# Altium schematic sheet H743ZI_SD_LCD_DRAM_Dev.SchDoc
size A1; SheetNumber: 1; SheetTotal: 1
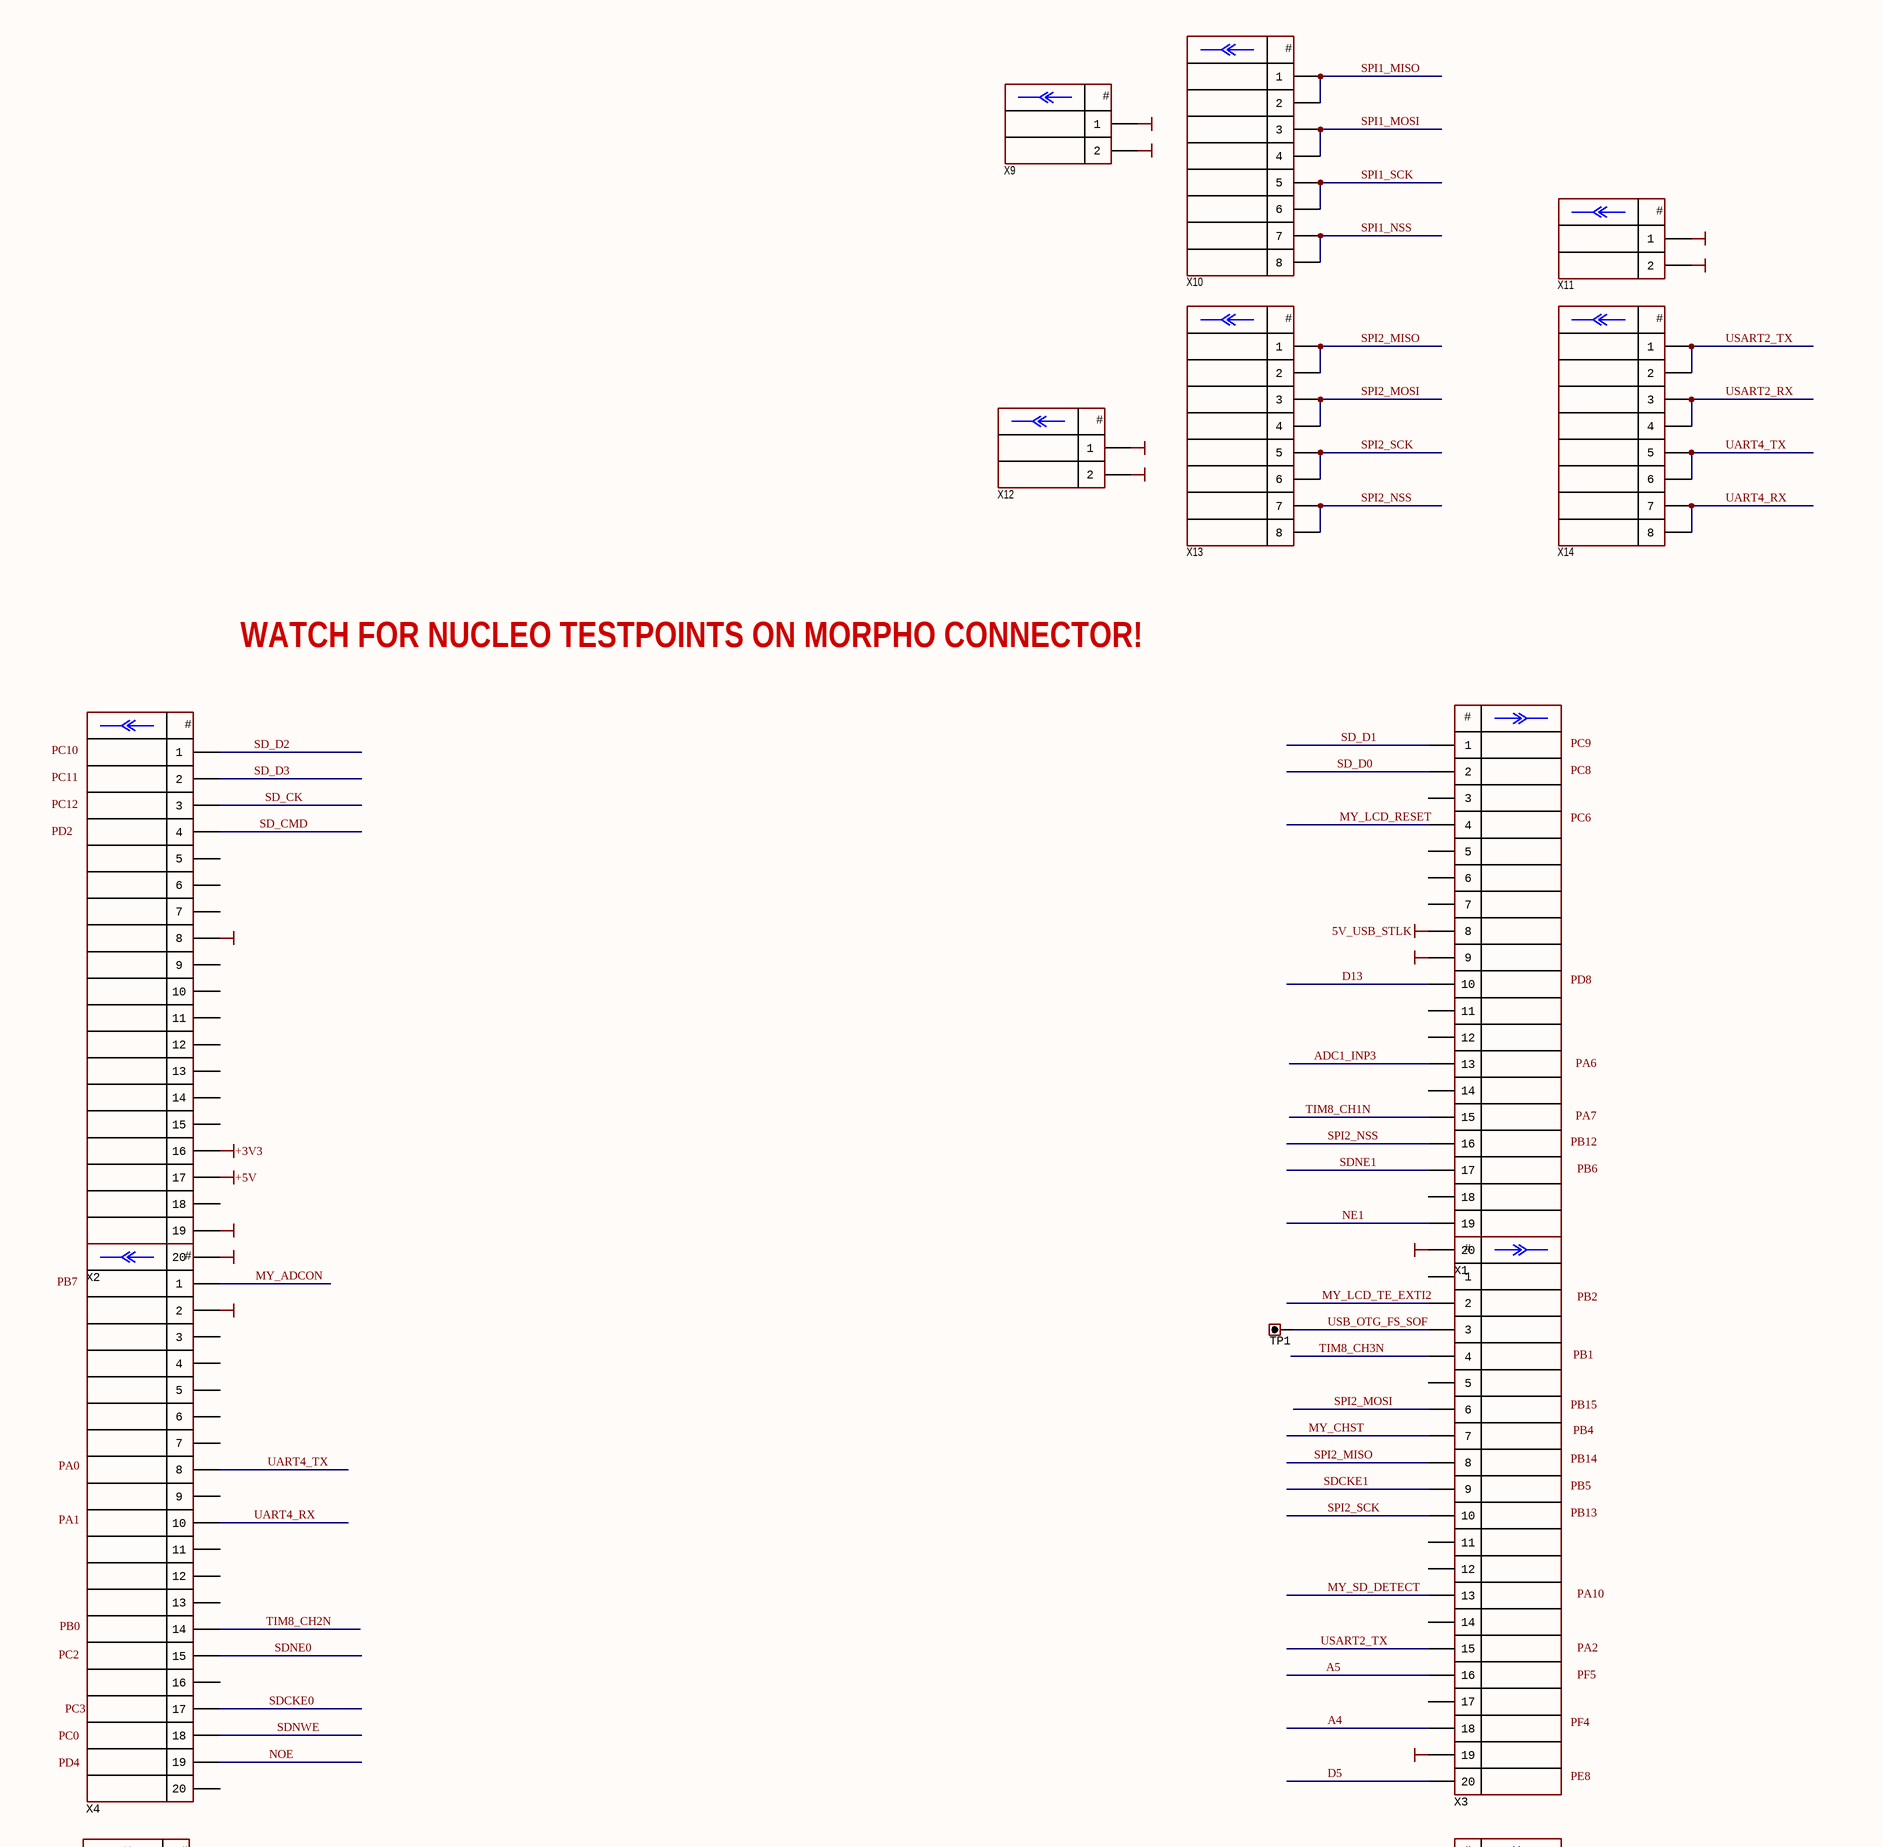
[diagram p0: H743ZI_SD_LCD_DRAM_Dev.SchDoc, top left]
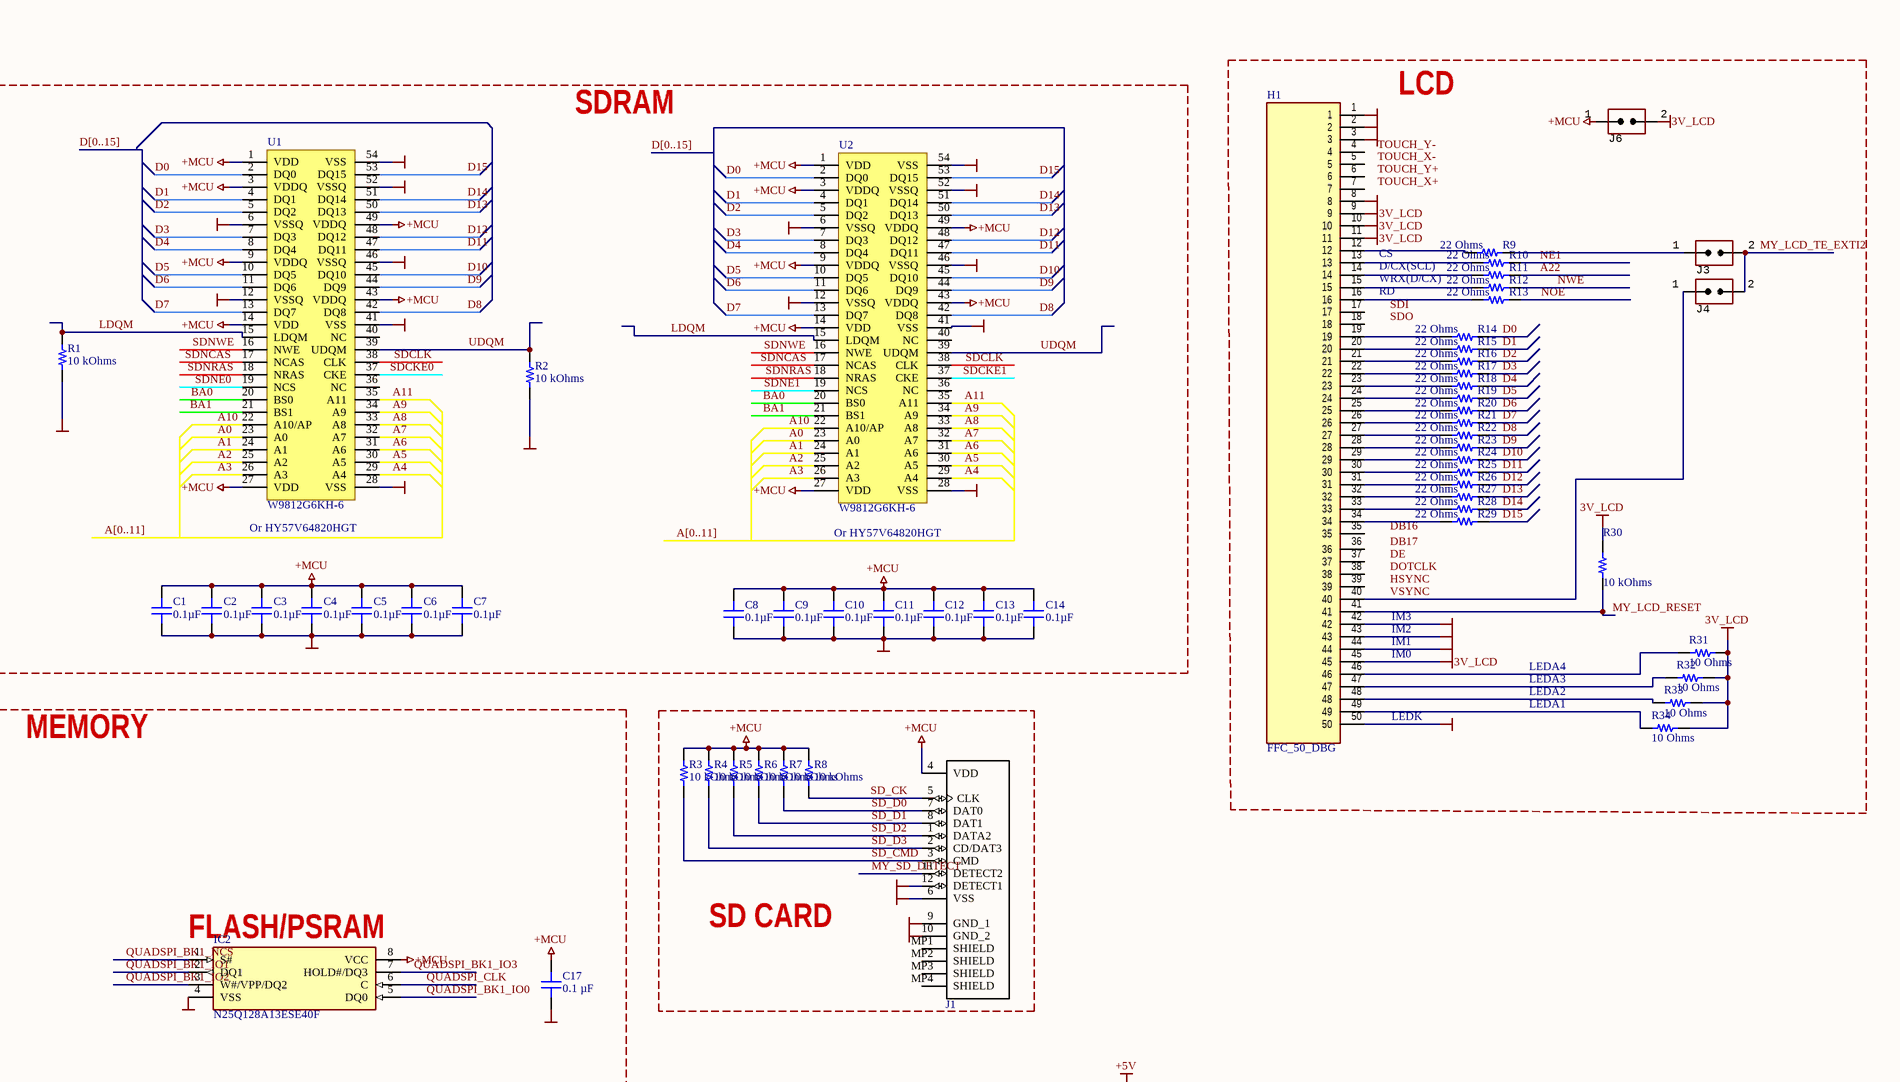
[diagram p1: H743ZI_SD_LCD_DRAM_Dev.SchDoc, top right]
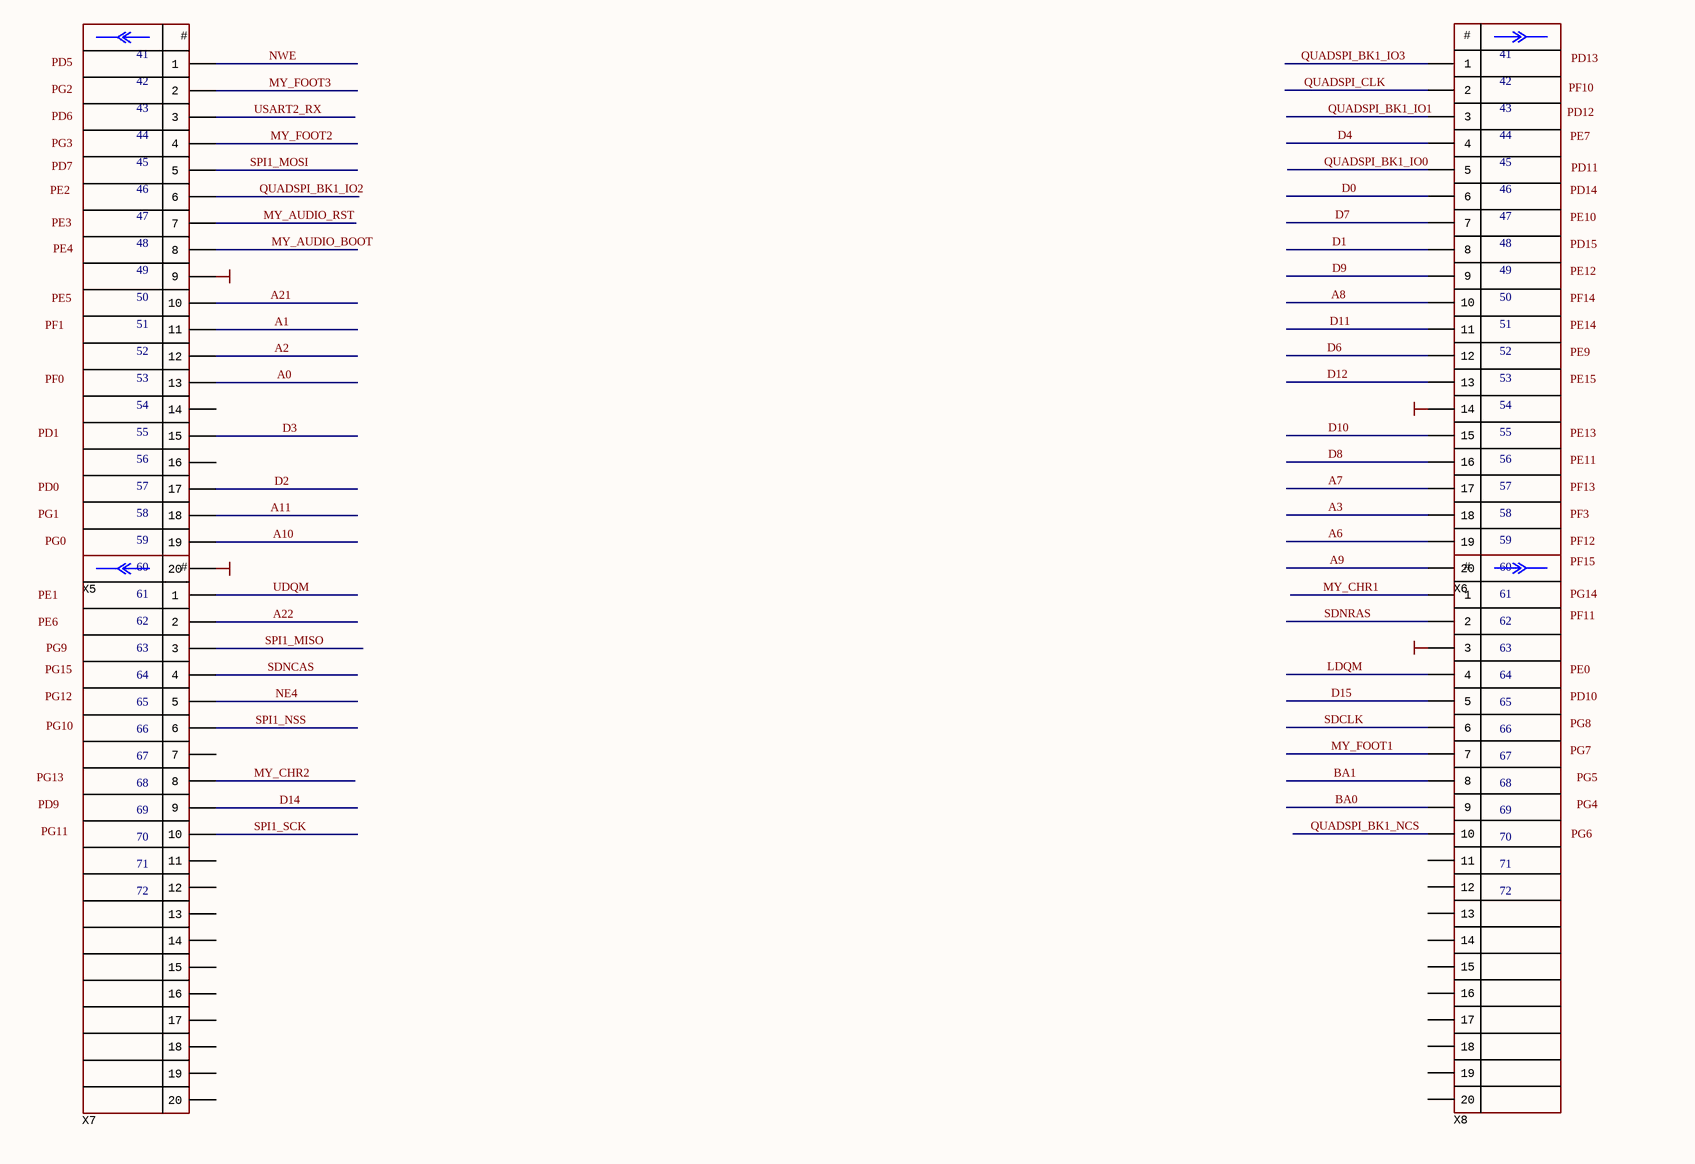
[diagram p2: H743ZI_SD_LCD_DRAM_Dev.SchDoc, bottom left]
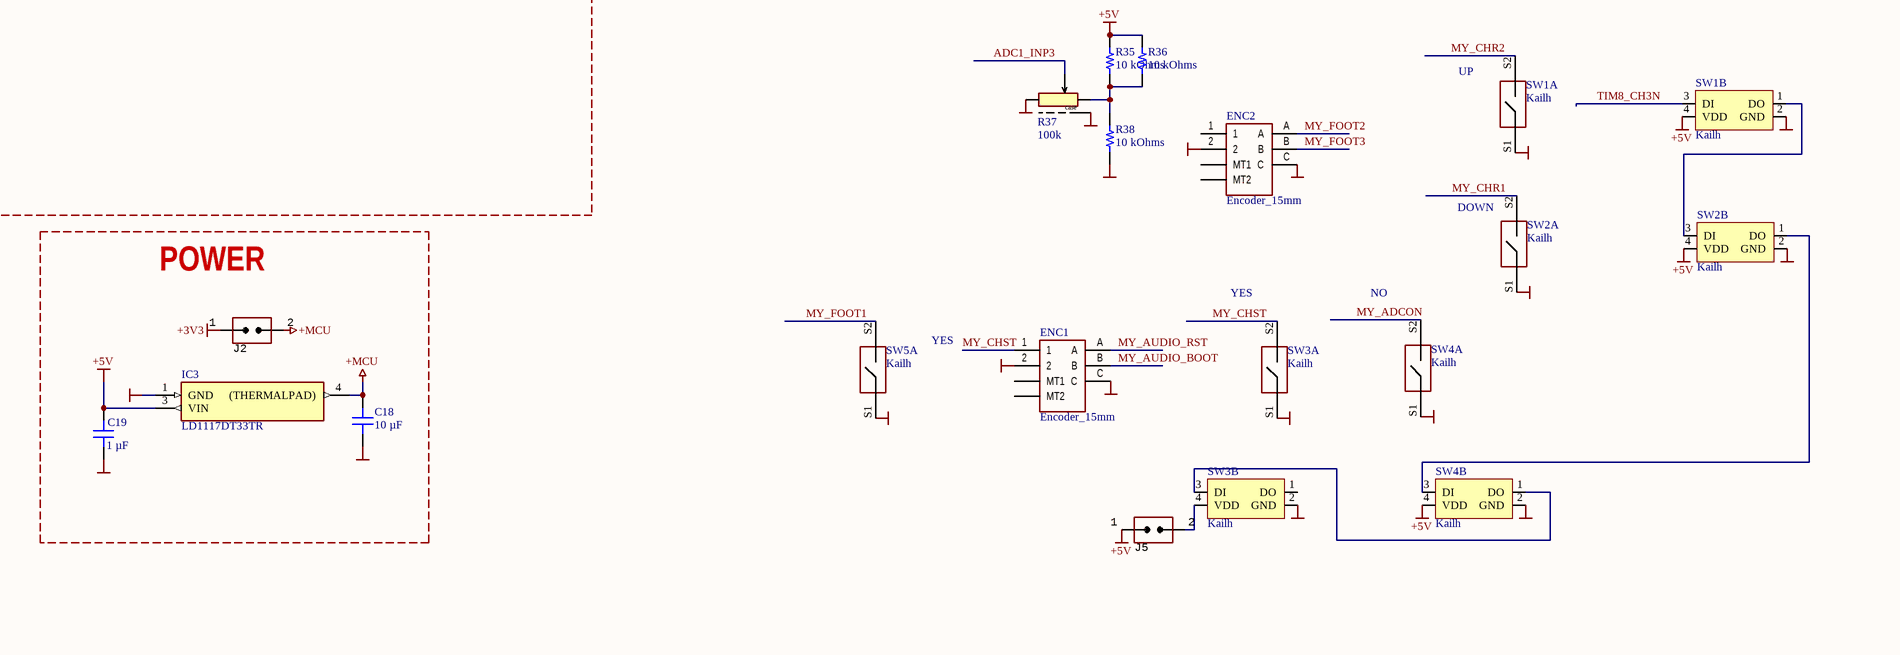
[diagram p3: H743ZI_SD_LCD_DRAM_Dev.SchDoc, bottom right]

## Parts
C1  0.1µF  [CAP 0402_1005]
C2  0.1µF  [CAP 0402_1005]
C3  0.1µF  [CAP 0402_1005]
C4  0.1µF  [CAP 0402_1005]
C5  0.1µF  [CAP 0402_1005]
C6  0.1µF  [CAP 0402_1005]
C7  0.1µF  [CAP 0402_1005]
C8  0.1µF  [CAP 0402_1005]
C9  0.1µF  [CAP 0402_1005]
C10  0.1µF  [CAP 0402_1005]
C11  0.1µF  [CAP 0402_1005]
C12  0.1µF  [CAP 0402_1005]
C13  0.1µF  [CAP 0402_1005]
C14  0.1µF  [CAP 0402_1005]
C17  0.1 µF  [CAP 0603_1608]
C18  10 µF  [CAP 0805_2012]
C19  1 µF  [CAP 0805_2012]
ENC1  Encoder_15mm  [EC11_15mm]
ENC2  Encoder_15mm  [EC11_15mm]
H1  FFC_50_DBG  [FFC_50_DBG]
IC2  N25Q128A13ESE40F  [SOIC127P790X216-8N]
IC3  LD1117DT33TR  [TO228P972X240-3N]
J1  SCHA4B0400  [SCHA4B0400]  (value not drawn)
J2  (no value)  [CON: JUMPER x1]
J3  (no value)  [CON: JUMPER x1]
J4  (no value)  [CON: JUMPER x1]
J5  (no value)  [CON: JUMPER x1]
J6  (no value)  [CON: JUMPER x1]
R1  10 kOhms  [RES 0603_1608]
R2  10 kOhms  [RES 0603_1608]
R3  10 kOhms  [RES 0603_1608]
R4  10 kOhms  [RES 0603_1608]
R5  10 kOhms  [RES 0603_1608]
R6  10 kOhms  [RES 0603_1608]
R7  10 kOhms  [RES 0603_1608]
R8  10 kOhms  [RES 0603_1608]
R9  22 Ohms  [RES 0402_1005]
R10  22 Ohms  [RES 0402_1005]
R11  22 Ohms  [RES 0402_1005]
R12  22 Ohms  [RES 0402_1005]
R13  22 Ohms  [RES 0402_1005]
R14  22 Ohms  [RES 0402_1005]
R15  22 Ohms  [RES 0402_1005]
R16  22 Ohms  [RES 0402_1005]
R17  22 Ohms  [RES 0402_1005]
R18  22 Ohms  [RES 0402_1005]
R19  22 Ohms  [RES 0402_1005]
R20  22 Ohms  [RES 0402_1005]
R21  22 Ohms  [RES 0402_1005]
R22  22 Ohms  [RES 0402_1005]
R23  22 Ohms  [RES 0402_1005]
R24  22 Ohms  [RES 0402_1005]
R25  22 Ohms  [RES 0402_1005]
R26  22 Ohms  [RES 0402_1005]
R27  22 Ohms  [RES 0402_1005]
R28  22 Ohms  [RES 0402_1005]
R29  22 Ohms  [RES 0402_1005]
R30  10 kOhms  [RES 0603_1608]
R31  10 Ohms  [RES 0603_1608]
R32  10 Ohms  [RES 0603_1608]
R33  10 Ohms  [RES 0603_1608]
R34  10 Ohms  [RES 0603_1608]
R35  10 kOhms  [RES 0603_1608]
R36  10 kOhms  [RES 0603_1608]
R37  100k  [POT]
R38  10 kOhms  [RES 0603_1608]
SW1  Kailh  [KAILH_UNI_MX_WS2812]  (parts A,B of 2)
SW2  Kailh  [KAILH_UNI_MX_WS2812]  (parts A,B of 2)
SW3  Kailh  [KAILH_UNI_MX_WS2812]  (parts A,B of 2)
SW4  Kailh  [KAILH_UNI_MX_WS2812]  (parts A,B of 2)
SW5  Kailh  [KAILH_UNI_MX_WS2812]  (part A of 2)
TP1  (no value)  [CON: 5116 (Keystone)]
U1  W9812G6KH-6  [TSOP-54]
U2  W9812G6KH-6  [TSOP-54]
X1  (no value)  [CON: PBD-20]
X2  (no value)  [CON: PBD-20]
X3  (no value)  [CON: PBD-20]
X4  (no value)  [CON: PBD-20]
X5  (no value)  [CON: PBD-20]
X6  (no value)  [CON: PBD-20]
X7  (no value)  [CON: PBD-20]
X8  (no value)  [CON: PBD-20]
X9  (no value)  [CON: PLS-2]
X10  (no value)  [CON: PLD-8]
X11  (no value)  [CON: PLS-2]
X12  (no value)  [CON: PLS-2]
X13  (no value)  [CON: PLD-8]
X14  (no value)  [CON: PLD-8]

## Blocks framed on the sheet
LCD: H1 J3 J4 J6 R9-R34
SDRAM: C1-C14 R1 R2 U1 U2
SD CARD: J1 R3-R8
POWER: C18 C19 IC3 J2

## Nets
3V_LCD: H1.9 H1.10 H1.11 H1.45 J6.2(IN) R30.2 R31.2 R32.2 R33.2 R34.2
5V_USB_STLK: X1.8
+3V3: J2.1(IN) X2.16
+5V: C19.2 IC3.3(VIN) J5.1(IN) R35.2 R36.2 SW1.4(VDD) SW2.4(VDD) SW4.4(VDD) X2.17
+MCU: C1.1 C2.1 C3.1 C4.1 C5.1 C6.1 C7.1 C8.1 C9.1 C10.1 C11.1 C12.1 C13.1 C14.1 C17.2 C18.2 IC2.8(VCC) IC3.4((THERMALPAD)) J1.4(VDD) J2.2(IN) J6.1(IN) R3.2 R4.2 R5.2 R6.2 R7.2 R8.2 U1.1(VDD) U1.3(VDDQ) U1.9(VDDQ) U1.14(VDD) U1.27(VDD) U1.43(VDDQ) U1.49(VDDQ) U2.1(VDD) U2.3(VDDQ) U2.9(VDDQ) U2.14(VDD) U2.27(VDD) U2.43(VDDQ) U2.49(VDDQ)
GND: C1.2 C2.2 C3.2 C4.2 C5.2 C6.2 C7.2 C8.2 C9.2 C10.2 C11.2 C12.2 C13.2 C14.2 C17.1 C18.1 C19.1 ENC1.2 ENC1.C ENC2.2 ENC2.C H1.1 H1.2 H1.3 H1.8 H1.42 H1.43 H1.44 H1.50 IC2.4(VSS) IC3.1(GND) J1.6(VSS) J1.9(GND_1) J1.10(GND_2) J1.12(DETECT1) R1.1 R2.1 R37.1 R37.4 R38.1 SW1.2(GND) SW1.S1 SW2.2(GND) SW2.S1 SW3.2(GND) SW3.S1 SW4.2(GND) SW4.S1 SW5.S1 U1.6(VSSQ) U1.12(VSSQ) U1.28(VSS) U1.41(VSS) U1.46(VSSQ) U1.52(VSSQ) U1.54(VSS) U2.6(VSSQ) U2.12(VSSQ) U2.28(VSS) U2.41(VSS) U2.46(VSSQ) U2.52(VSSQ) U2.54(VSS) X1.9 X1.20 X2.8 X2.19 X2.20 X3.19 X4.2 X5.9 X5.20 X6.14 X8.3 X9.1 X9.2 X11.1 X11.2 X12.1 X12.2
A0: U1.23(A0) U2.23(A0) X5.13
A1: U1.24(A1) U2.24(A1) X5.11
A2: U1.25(A2) U2.25(A2) X5.12
A3: U1.26(A3) U2.26(A3) X6.18
A4: U1.29(A4) U2.29(A4) X3.18
A5: U1.30(A5) U2.30(A5) X3.16
A6: U1.31(A6) U2.31(A6) X6.19
A7: U1.32(A7) U2.32(A7) X6.17
A8: U1.33(A8) U2.33(A8) X6.10
A9: U1.34(A9) U2.34(A9) X6.20
A10: U1.22(A10/AP) U2.22(A10/AP) X5.19
A11: U1.35(A11) U2.35(A11) X5.18
A21: X5.10
A22: R11.2 X7.2
ADC1_INP3: R37.2 X1.13
BA0: U1.20(BS0) U2.20(BS0) X8.9
BA1: U1.21(BS1) U2.21(BS1) X8.8
D0: R14.2 U1.2(DQ0) U2.2(DQ0) X6.6
D1: R15.2 U1.4(DQ1) U2.4(DQ1) X6.8
D2: R16.2 U1.5(DQ2) U2.5(DQ2) X5.17
D3: R17.2 U1.7(DQ3) U2.7(DQ3) X5.15
D4: R18.2 U1.8(DQ4) U2.8(DQ4) X6.4
D5: R19.2 U1.10(DQ5) U2.10(DQ5) X3.20
D6: R20.2 U1.11(DQ6) U2.11(DQ6) X6.12
D7: R21.2 U1.13(DQ7) U2.13(DQ7) X6.7
D8: R22.2 U1.42(DQ8) U2.42(DQ8) X6.16
D9: R23.2 U1.44(DQ9) U2.44(DQ9) X6.9
D10: R24.2 U1.45(DQ10) U2.45(DQ10) X6.15
D11: R25.2 U1.47(DQ11) U2.47(DQ11) X6.11
D12: R26.2 U1.48(DQ12) U2.48(DQ12) X6.13
D13: R27.2 U1.50(DQ13) U2.50(DQ13) X1.10
D14: R28.2 U1.51(DQ14) U2.51(DQ14) X7.9
D15: R29.2 U1.53(DQ15) U2.53(DQ15) X8.5
LDQM: R1.2 U1.15(LDQM) U2.15(LDQM) X8.4
MY_ADCON: SW4.S2 X4.1
MY_AUDIO_BOOT: ENC1.B X5.8
MY_AUDIO_RST: ENC1.A X5.7
MY_CHR1: SW2.S2 X8.1
MY_CHR2: SW1.S2 X7.8
MY_CHST: ENC1.1 SW3.S2 X3.7
MY_FOOT1: SW5.S2 X8.7
MY_FOOT2: ENC2.A X5.4
MY_FOOT3: ENC2.B X5.2
MY_LCD_RESET: H1.41 R30.1 X1.4
MY_LCD_TE_EXTI2: J3.2(IN) J4.2(IN) X3.2
MY_SD_DETECT: J1.11(DETECT2) X3.13
NE1: R10.2 X1.19
NE4: X7.5
NOE: R13.2 X4.19
NWE: R12.2 X5.1
QUADSPI_BK1_IO0: IC2.5(DQ0) X6.5
QUADSPI_BK1_IO1: IC2.2(DQ1) X6.3
QUADSPI_BK1_IO2: IC2.3(W#/VPP/DQ2) X5.6
QUADSPI_BK1_IO3: IC2.7(HOLD#/DQ3) X6.1
QUADSPI_BK1_NCS: IC2.1(S#) X8.10
QUADSPI_CLK: IC2.6(C) X6.2
SD_CK: J1.5(CLK) R8.1 X2.3
SD_CMD: J1.3(CMD) R3.1 X2.4
SD_D0: J1.7(DAT0) R7.1 X1.2
SD_D1: J1.8(DAT1) R6.1 X1.1
SD_D2: J1.1(DATA2) R5.1 X2.1
SD_D3: J1.2(CD/DAT3) R4.1 X2.2
SDCKE0: U1.37(CKE) X4.17
SDCKE1: U2.37(CKE) X3.9
SDCLK: U1.38(CLK) U2.38(CLK) X8.6
SDNCAS: U1.17(NCAS) U2.17(NCAS) X7.4
SDNE0: U1.19(NCS) X4.15
SDNE1: U2.19(NCS) X1.17
SDNRAS: U1.18(NRAS) U2.18(NRAS) X8.2
SDNWE: U1.16(NWE) U2.16(NWE) X4.18
SPI1_MISO: X7.3 X10.1 X10.2
SPI1_MOSI: X5.5 X10.3 X10.4
SPI1_NSS: X7.6 X10.7 X10.8
SPI1_SCK: X7.10 X10.5 X10.6
SPI2_MISO: X3.8 X13.1 X13.2
SPI2_MOSI: X3.6 X13.3 X13.4
SPI2_NSS: X1.16 X13.7 X13.8
SPI2_SCK: X3.10 X13.5 X13.6
TIM8_CH1N: X1.15
TIM8_CH2N: X4.14
TIM8_CH3N: SW1.3(DI) X3.4
UART4_RX: X4.10 X14.7 X14.8
UART4_TX: X4.8 X14.5 X14.6
UDQM: R2.2 U1.39(UDQM) U2.39(UDQM) X7.1
USART2_RX: X5.3 X14.3 X14.4
USART2_TX: X3.15 X14.1 X14.2
USB_OTG_FS_SOF: TP1.1 X3.3
VSYNC: H1.40 J4.1(IN)
NetH1_12: H1.12 R9.1
NetH1_13: H1.13 R10.1
NetH1_14: H1.14 R11.1
NetH1_15: H1.15 R12.1
NetH1_16: H1.16 R13.1
NetH1_19: H1.19 R14.1
NetH1_20: H1.20 R15.1
NetH1_21: H1.21 R16.1
NetH1_22: H1.22 R17.1
NetH1_23: H1.23 R18.1
NetH1_24: H1.24 R19.1
NetH1_25: H1.25 R20.1
NetH1_26: H1.26 R21.1
NetH1_27: H1.27 R22.1
NetH1_28: H1.28 R23.1
NetH1_29: H1.29 R24.1
NetH1_30: H1.30 R25.1
NetH1_31: H1.31 R26.1
NetH1_32: H1.32 R27.1
NetH1_33: H1.33 R28.1
NetH1_34: H1.34 R29.1
NetH1_46: H1.46 R31.1
NetH1_47: H1.47 R32.1
NetH1_48: H1.48 R33.1
NetH1_49: H1.49 R34.1
NetJ3_1: J3.1(IN) R9.2
NetJ5_2: J5.2(IN) SW3.4(VDD)
NetR35_1: R35.1 R36.1 R37.3 R38.2
NetSW1_1: SW1.1(DO) SW2.3(DI)
NetSW2_1: SW2.1(DO) SW4.3(DI)
NetSW3_3: SW3.3(DI) SW4.1(DO)

Not connected (* = marked no-connect by the designer): ENC1 MT1 MT2; ENC2 1 MT1 MT2; H1 4 5 6 7 17 18 35 36 37 38 39; J1 MP1(SHIELD) MP2(SHIELD) MP3(SHIELD) MP4(SHIELD); SW3 1(DO); U1 36(NC) 40(NC); U2 36(NC) 40(NC); X1 3 5 6 7 11 12 14 18; X2 5 6 7 9 10 11 12 13 14 15 18; X3 1 5 11 12 14 17; X4 3 4 5 6 7 9 11 12 13 16 20; X5 14 16; X7 7 11 12 13 14 15 16 17 18 19 20; X8 11 12 13 14 15 16 17 18 19 20

## Buses and harness runs
bus A[0..11]
bus D[0..15]

## Notes on the sheet
- D/CX(SCL)
- (near H1) CS
- WRX(D/CX)
- (near H1) RD
- WATCH FOR NUCLEO TESTPOINTS ON MORPHO CONNECTOR!
- (near U1) Or HY57V64820HGT
- (near U2) Or HY57V64820HGT
- IM0
- IM1
- IM2
- IM3
- LEDA4
- LEDK
- LEDA1
- LEDA2
- LEDA3
- MEMORY
- (near IC2) FLASH/PSRAM
- (near SW1) UP
- (near SW2) DOWN
- YES
- NO
- (near X5) 41
- (near X6) 41
- (near X5) 42
- (near X5) 43
- (near X5) 44
- (near X6) 42
- (near X6) 43
- (near X6) 44
- (near X5) 45
- (near X5) 46
- (near X6) 45
- (near X6) 46
- (near X5) 47
- (near X5) 48
- (near X5) 49
- (near X6) 47
- (near X6) 48
- (near X6) 49
- (near X5) 50
- (near X5) 51
- (near X6) 50
- (near X6) 51
- (near X5) 52
- (near X5) 53
- (near X5) 54
- (near X6) 52
- (near X6) 53
- (near X6) 54
- (near X5) 55
- (near X5) 56
- (near X6) 55
- (near X6) 56
- (near X5) 57
- (near X5) 58
- 59
- (near X6) 57
- (near X6) 58
- 60
- 61
- 62
- (near X7) 63
- (near X7) 64
- (near X8) 63
- (near X8) 64
- (near X7) 65
- (near X7) 66
- (near X8) 65
- (near X8) 66
- (near X7) 67
- (near X7) 68
- (near X7) 69
- (near X8) 67
- (near X8) 68
- (near X8) 69
- (near X7) 70
- (near X7) 71
- (near X8) 70
- (near X8) 71
- (near X7) 72
- (near X8) 72
- Labels drawn without touching a wire or pin: DB16, DB17, DE, DOTCLK, HSYNC, PA0, PA1, PA2, PA6, PA7, PA10, PB0, PB1, PB2, PB4, PB5, PB6, PB7, PB12, PB13, PB14, PB15, PC0, PC2, PC3, PC6, PC8, PC9, PC10, PC11, PC12, PD0, PD1, PD2, PD4, PD5, PD6, PD7, PD8, PD9, PD10, PD11, PD12, PD13, PD14, PD15, PE0, PE1, PE2, PE3, PE4, PE5, PE6, PE7, PE8, PE9, PE10, PE11, PE12, PE13, PE14, PE15, PF0, PF1, PF3, PF4, PF5, PF10, PF11, PF12, PF13, PF14, PF15, PG0, PG1, PG2, PG3, PG4, PG5, PG6, PG7, PG8, PG9, PG10, PG11, PG12, PG13, PG14, PG15, SDI, SDO, TOUCH_X+, TOUCH_X-, TOUCH_Y+, TOUCH_Y-
- (in symbol PBD-20) #
- (in symbol PLD-8) #
- (in symbol PLS-2) #
- (in symbol POT 9MM 100K) case

## Library data of the parts
C1-C14 = C0402C104K4RACAUTO: CAP CER 0.1UF 16V X7R 0402; Manufacturer: KEMET; Tolerance: ±10%; Part Number: C0402C104K4RACAUTO; Value: 0.1µF; Applications: Automotive, Bypass, Decoupling; Capacitance: 0.1µF; ComponentLink1Description: Datasheet; ComponentLink1URL: https://api.kemet.com/component-edge/download/specsheet/C0402C104K4RACAUTO.pdf; ComponentLink2Description: DigiKey Link; ComponentLink2URL: http://digikey.com/product-detail/en/kemet/C0402C104K4RACAUTO/399-6828-1-ND/3314343; Device Package: 0402 (1005 Metric); LastUpdated: 9/2/2020 1:02:21 AM; Lifecycle Status: Active; Minimum Order: 1; Mounting Type: Surface Mount, MLCC; Operating Temperature: -55°C ~ 125°C; Package / Case: 0402 (1005 Metric); Packaging: TapeAndReel; PartId: 3024; Part Status: Active; Price: 0.01; Ratings: AEC-Q200; Series: SMD Auto X7R; Size / Dimension: 0.039" L x 0.020" W (1.00mm x 0.50mm); Supplier 1: DigiKey; Supplier Part Number 1: 399-6828-1-ND; Temperature Coefficient: X7R; Thickness (Max): 0.022" (0.55mm); Voltage - Rated: 16V
C17 = C0603C104K5RAC7411: CAP CER 0.1UF 50V X7R 0603; manufacturer: KEMET; Tolerance: ±10%; Part Number: C0603C104K5RAC7411; Value: 0.1 µF; Applications: Bypass, Decoupling; Capacitance: 0.1 µF; componentlink1description: Datasheet; componentlink1url: https://api.kemet.com/component-edge/download/datasheet/C0603C104K5RAC7411.pdf; componentlink2description: DigiKey Link; componentlink2url: https://www.digikey.com/en/products/detail/kemet/C0603C104K5RAC7411/3317013; Device Package: 0603 (1608 Metric); lastupdated: 2/9/2024 8:10:30 PM; Lifecycle Status: Active; Minimum Order: 1; Mounting Type: Surface Mount, MLCC; Operating Temperature: -55°C ~ 125°C; Package / Case: 0603 (1608 Metric); packaging: TapeAndReel; partid: 2233; Part Status: Active; price: 0.01; series: SMD Comm X7R; Size / Dimension: 0.063" L x 0.031" W (1.60mm x 0.80mm); Supplier 1: DigiKey; Supplier Part Number 1: 399-C0603C104K5RAC7411CT-ND; Temperature Coefficient: X7R; Thickness (Max): 0.035" (0.90mm); Voltage - Rated: 50V
C18 = C0805C106K8PAC7800: CAP CER 10UF 10V X5R 0805; manufacturer: KEMET; Tolerance: ±10%; Part Number: C0805C106K8PAC7800; Value: 10 µF; Applications: Bypass, Decoupling; Capacitance: 10 µF; componentlink1description: Datasheet; componentlink1url: https://connect.kemet.com:7667/gateway/IntelliData-ComponentDocumentation/1.0/download/datasheet/C0805C106K8PACTU; componentlink2description: DigiKey Link; componentlink2url: https://www.digikey.com/en/products/detail/kemet/C0805C106K8PAC7800/1090830; Device Package: 0805 (2012 Metric); lastupdated: 9/14/2022 7:51:56 AM; Lifecycle Status: Active; Minimum Order: 1; Mounting Type: Surface Mount, MLCC; Operating Temperature: -55°C ~ 85°C; Package / Case: 0805 (2012 Metric); packaging: TapeAndReel; partid: 44790; Part Status: Active; price: 0.02; series: SMD Comm X5R; Size / Dimension: 0.079" L x 0.049" W (2.00mm x 1.25mm); Supplier 1: DigiKey; Supplier Part Number 1: 399-C0805C106K8PAC7800CT-ND; Temperature Coefficient: X5R; Thickness (Max): 0.055" (1.40mm); Voltage - Rated: 10V
C19 = C0805C105K4RAC7800: CAP CER 1UF 16V X7R 0805; manufacturer: KEMET; Tolerance: ±10%; Part Number: C0805C105K4RAC7800; Value: 1 µF; Applications: Bypass, Decoupling; Capacitance: 1 µF; componentlink1description: Datasheet; componentlink1url: https://api.kemet.com/component-edge/download/datasheet/C0805C105K4RACTU.pdf; componentlink2description: DigiKey Link; componentlink2url: https://www.digikey.com/en/products/detail/kemet/C0805C105K4RAC7800/416047; Device Package: 0805 (2012 Metric); lastupdated: 9/19/2022 1:03:30 PM; Lifecycle Status: Active; Minimum Order: 1; Mounting Type: Surface Mount, MLCC; Operating Temperature: -55°C ~ 125°C; Package / Case: 0805 (2012 Metric); packaging: TapeAndReel; partid: 32075; Part Status: Active; price: 0.01; series: SMD Comm X7R; Size / Dimension: 0.079" L x 0.049" W (2.00mm x 1.25mm); Supplier 1: DigiKey; Supplier Part Number 1: 399-C0805C105K4RAC7800CT-ND; Temperature Coefficient: X7R; Thickness (Max): 0.039" (1.00mm); Voltage - Rated: 16V
H1 = FFC_50_DBG: System: Connector
IC2 = N25Q128A13ESE40F: Integrated Circuit; Manufacturer_Name: Micron; Datasheet Link: https://datasheet.datasheetarchive.com/originals/distributors/Datasheets-DGA23/1494983.pdf; Height: 2.16mm; Manufacturer_Part_Number: N25Q128A13ESE40F; Mouser Part Number: 340-182267; Mouser Price/Stock: https://www.mouser.co.uk/ProductDetail/Micron/N25Q128A13ESE40F?qs=taEdVNyAfdHw8xv9Y4zfpQ%3D%3D; Arrow Part Number: N25Q128A13ESE40F; Arrow Price/Stock: https://www.arrow.com/en/products/n25q128a13ese40f/micron-technology
IC3 = LD1117DT33TR: Integrated Circuit; Manufacturer_Name: STMicroelectronics; Datasheet Link: http://www.st.com/web/en/resource/technical/document/datasheet/CD00000544.pdf; Height: 2.4mm; Manufacturer_Part_Number: LD1117DT33TR; Mouser Part Number: 511-LD1117DT33-TR; Mouser Price/Stock: https://www.mouser.co.uk/ProductDetail/STMicroelectronics/LD1117DT33TR?qs=4JhUBQGAOSd4P5jVYGxp2g%3D%3D; Arrow Part Number: LD1117DT33TR; Arrow Price/Stock: https://www.arrow.com/en/products/ld1117dt33tr/stmicroelectronics?region=nac
J1 = SCHA4B0400: SD card Connector; Manufacturer_Name: ALPS Electric; Datasheet Link: https://br.mouser.com/datasheet/2/15/SCHA-1155938.pdf; Height: 1.29mm; Manufacturer_Part_Number: SCHA4B0400; Mouser Part Number: 688-SCHA4B0400; Mouser Price/Stock: https://www.mouser.com/Search/Refine.aspx?Keyword=688-SCHA4B0400
J2-J6 = Jumper_single: CommentText: "Перемычка"
R1-R8 R30 = ERJ-3EKF1002V: RES SMD 10K OHM 1% 1/10W 0603; Manufacturer: Panasonic Electronic Components; Power (Watts): 0.1W, 1/10W; Temperature Coefficient: ±100ppm/°C; Part Number: ERJ-3EKF1002V; Value: 10 kOhms; ComponentLink1Description: Datasheet; ComponentLink1URL: https://industrial.panasonic.com/cdbs/www-data/pdf/RDA0000/AOA0000C304.pdf; ComponentLink2Description: DigiKey Link; ComponentLink2URL: https://www.digikey.com/en/products/detail/panasonic-electronic-components/ERJ-3EKF1002V/196066; Composition: Thick Film; Device Package: 0603 (1608 Metric); Height - Seated (Max): 0.022" (0.55mm); LastUpdated: 2/9/2024 8:41:59 PM; Lifecycle Status: Active; Minimum Order: 1; Number of Terminations: 2; Operating Temperature: -55°C ~ 155°C; Package / Case: 0603 (1608 Metric); Packaging: TapeAndReel; PartId: 25695; Part Status: Active; Price: 0.01; Resistance: 10 kOhms; Series: ERJ-3EK; Size / Dimension: 0.063" L x 0.031" W (1.60mm x 0.80mm); Supplier 1: DigiKey; Supplier Part Number 1: P10.0KHCT-ND; Supplier Device Package: 0603; Tolerance: ±1%; Features: Automotive AEC-Q200; Ratings: AEC-Q200
R9-R29 = RMCF0402JT22R0: RES 22 OHM 5% 1/16W 0402; Manufacturer: Stackpole Electronics Inc; Power (Watts): 0.063W, 1/16W; Temperature Coefficient: ±100ppm/°C; Part Number: RMCF0402JT22R0; Value: 22 Ohms; ComponentLink1Description: Datasheet; ComponentLink1URL: https://www.seielect.com/catalog/sei-rmcf_rmcp.pdf; ComponentLink2Description: DigiKey Link; ComponentLink2URL: https://www.digikey.com/en/products/detail/stackpole-electronics-inc/RMCF0402JT22R0/1758165; Composition: Thick Film; Device Package: 0402 (1005 Metric); Features: Automotive AEC-Q200; Height - Seated (Max): 0.016" (0.40mm); LastUpdated: 2/9/2024 8:30:03 PM; Lifecycle Status: Active; Minimum Order: 1; Number of Terminations: 2; Operating Temperature: -55°C ~ 155°C; Package / Case: 0402 (1005 Metric); Packaging: CutTape; PartId: 7671; Part Status: Active; Price: 0.01; Resistance: 22 Ohms; Series: RMCF; Size / Dimension: 0.039" L x 0.020" W (1.00mm x 0.50mm); Supplier 1: DigiKey; Supplier Part Number 1: RMCF0402JT22R0CT-ND; Supplier Device Package: 0402; Tolerance: ±5%; Ratings: AEC-Q200
R31-R34 = ERJ-PA3F10R0V: RES SMD 10 OHM 1% 1/3W 0603; Manufacturer: Panasonic Electronic Components; Power (Watts): 0.333W, 1/3W; Temperature Coefficient: ±100ppm/°C; Part Number: ERJ-PA3F10R0V; Value: 10 Ohms; ComponentLink1Description: Datasheet; ComponentLink1URL: https://industrial.panasonic.com/cdbs/www-data/pdf/RDO0000/AOA0000C331.pdf; ComponentLink2Description: DigiKey Link; ComponentLink2URL: https://www.digikey.com/en/products/detail/panasonic-electronic-components/ERJ-PA3F10R0V/5035852; Composition: Thick Film; Device Package: 0603 (1608 Metric); Features: Automotive AEC-Q200, Pulse Withstanding; Height - Seated (Max): 0.022" (0.55mm); Lifecycle Status: Active; Minimum Order: 1; Number of Terminations: 2; Operating Temperature: -55°C ~ 155°C; Package / Case: 0603 (1608 Metric); Packaging: TapeAndReel; PartId: 5368; Part Status: Active; Price: 0.01; Ratings: AEC-Q200; Resistance: 10 Ohms; Series: ERJ-PA3; Size / Dimension: 0.063" L x 0.031" W (1.60mm x 0.80mm); Supplier 1: DigiKey; Supplier Part Number 1: P10.00BYCT-ND; Supplier Device Package: 0603; Tolerance: ±1%
  R31: LastUpdated: 2/9/2024 8:43:35 PM
  R32-R34: LastUpdated: 9/16/2023 7:33:50 PM
R35 R36 R38 = ERJ-3EKF1002V: RES SMD 10K OHM 1% 1/10W 0603; Part Number: ERJ-3EKF1002V; Value: 10 kOhms
R37 = POT 9MM 100K
SW1-SW5 = Kailh_hotswap_WS2812: Kailh keyboard switch, hotswap rgb, dual-side hotswap options + low prifile variant
TP1 = Connector_Test_Point: Manufacturer: Keystone; ValueManufacturerPartNumber: Test point, Keystone, 5001; PartNumber: 5001; TypeConnector: Test point; HelpURL: https://www.digikey.com/product-detail/en/keystone-electronics/5001/36-5001-ND/255327
X1-X8 = PBD-20: Manufacturer: Connfly; ValueManufacturerPartNumber: Connector, 20pin, 2.54mm, 500VAC, 3A; TypeConnector: Connector; VoltageMax: 500VAC; Pitch: 2.54mm; CurrentMax: 3A; Multichannel: 20pin; CommentText: "Разъем"; HelpURL: https://www.chipdip.ru/product/pbd-20; PartNumber: PBD-20
X9 X11 X12 = PLS-2: Manufacturer: Connfly; ValueManufacturerPartNumber: Connector, 2pin, 2.54mm, 500VAC, 3A; TypeConnector: Connector; VoltageMax: 500VAC; Pitch: 2.54mm; CurrentMax: 3A; Multichannel: 2pin; CommentText: "Разъем"; HelpURL: https://www.chipdip.ru/product/pls-2; PartNumber: PLS-2
X10 X13 X14 = PLD-8: Manufacturer: Connfly; ValueManufacturerPartNumber: Connector, 8pin, 2.54mm, 500VAC, 3A; TypeConnector: Connector; VoltageMax: 500VAC; Pitch: 2.54mm; CurrentMax: 3A; Multichannel: 8pin; CommentText: "Разъем"; HelpURL: https://www.chipdip.ru/product/pld-8-ds1021-2x4; PartNumber: PLD-8